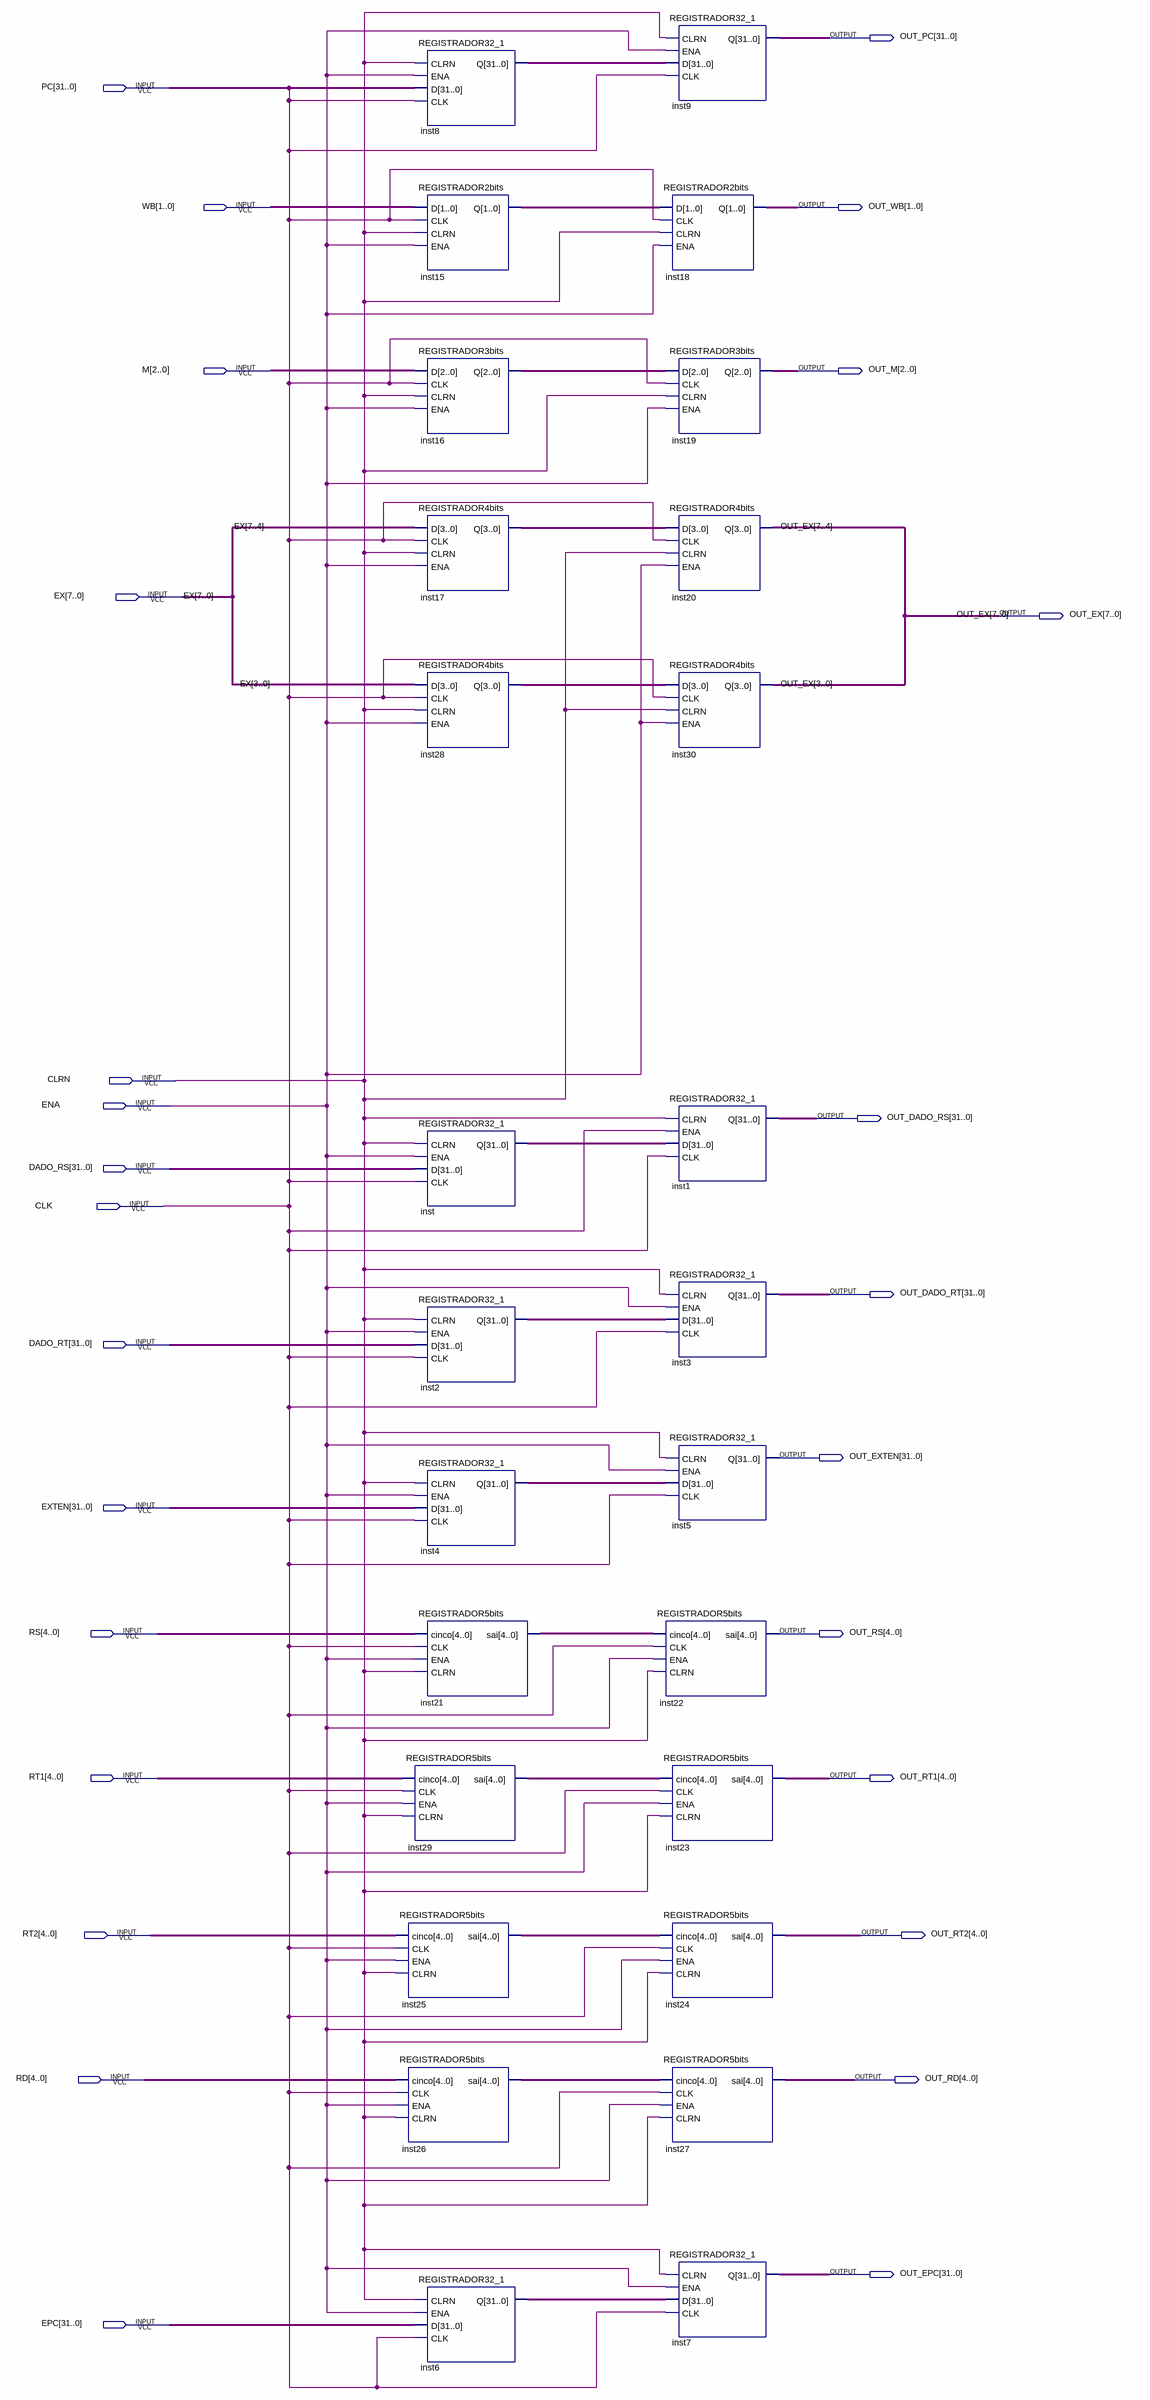
[diagram p0: schematic sheet]
// Quartus schematic ID_PARA_EX.bdf as structural Verilog: 26 symbols, 27 pins
module ID_PARA_EX (
  input  [31:0] PC,
  input  [1:0] WB,
  input  [2:0] M,
  input  [7:0] EX,
  input  CLRN,
  input  ENA,
  input  [31:0] DADO_RS,
  input  CLK,
  input  [31:0] DADO_RT,
  input  [31:0] EXTEN,
  input  [4:0] RS,
  input  [4:0] RT1,
  input  [4:0] RT2,
  input  [4:0] RD,
  input  [31:0] EPC,
  output [31:0] OUT_PC,
  output [1:0] OUT_WB,
  output [2:0] OUT_M,
  output [7:0] OUT_EX,
  output [31:0] OUT_DADO_RS,
  output [31:0] OUT_DADO_RT,
  output [31:0] OUT_EXTEN,
  output [4:0] OUT_RS,
  output [4:0] OUT_RT1,
  output [4:0] OUT_RT2,
  output [4:0] OUT_RD,
  output [31:0] OUT_EPC
);

  wire [1:0] inst15_q;
  wire [2:0] inst16_q;
  wire [3:0] inst17_q, inst28_q;
  wire [4:0] inst21_sai, inst25_sai, inst26_sai, inst29_sai;
  wire [31:0] inst2_q, inst4_q, inst6_q, inst8_q, inst_q;

  REGISTRADOR32_1 inst8 (.CLRN(CLRN), .ENA(ENA), .D(PC), .CLK(CLK), .Q(inst8_q));
  REGISTRADOR2bits inst15 (.D(WB), .CLK(CLK), .CLRN(CLRN), .ENA(ENA), .Q(inst15_q));
  REGISTRADOR3bits inst16 (.D(M), .CLK(CLK), .CLRN(CLRN), .ENA(ENA), .Q(inst16_q));
  REGISTRADOR4bits inst17 (.D(EX[7:4]), .CLK(CLK), .CLRN(CLRN), .ENA(ENA), .Q(inst17_q));
  REGISTRADOR4bits inst28 (.D(EX[3:0]), .CLK(CLK), .CLRN(CLRN), .ENA(ENA), .Q(inst28_q));
  REGISTRADOR32_1 inst (.CLRN(CLRN), .ENA(ENA), .D(DADO_RS), .CLK(CLK), .Q(inst_q));
  REGISTRADOR32_1 inst2 (.CLRN(CLRN), .ENA(ENA), .D(DADO_RT), .CLK(CLK), .Q(inst2_q));
  REGISTRADOR32_1 inst4 (.CLRN(CLRN), .ENA(ENA), .D(EXTEN), .CLK(CLK), .Q(inst4_q));
  REGISTRADOR5bits inst21 (.cinco(RS), .CLK(CLK), .ENA(ENA), .CLRN(CLRN), .sai(inst21_sai));
  REGISTRADOR5bits inst29 (.cinco(RT1), .CLK(CLK), .ENA(ENA), .CLRN(CLRN), .sai(inst29_sai));
  REGISTRADOR5bits inst25 (.cinco(RT2), .CLK(CLK), .ENA(ENA), .CLRN(CLRN), .sai(inst25_sai));
  REGISTRADOR5bits inst26 (.cinco(RD), .CLK(CLK), .ENA(ENA), .CLRN(CLRN), .sai(inst26_sai));
  REGISTRADOR32_1 inst6 (.CLRN(CLRN), .ENA(ENA), .D(EPC), .CLK(CLK), .Q(inst6_q));
  REGISTRADOR32_1 inst9 (.CLRN(CLRN), .ENA(ENA), .D(inst8_q), .CLK(CLK), .Q(OUT_PC));
  REGISTRADOR2bits inst18 (.D(inst15_q), .CLK(CLK), .CLRN(CLRN), .ENA(ENA), .Q(OUT_WB));
  REGISTRADOR3bits inst19 (.D(inst16_q), .CLK(CLK), .CLRN(CLRN), .ENA(ENA), .Q(OUT_M));
  REGISTRADOR4bits inst20 (.D(inst17_q), .CLK(CLK), .CLRN(CLRN), .ENA(ENA), .Q(OUT_EX[7:4]));
  REGISTRADOR4bits inst30 (.D(inst28_q), .CLK(CLK), .CLRN(CLRN), .ENA(ENA), .Q(OUT_EX[3:0]));
  REGISTRADOR32_1 inst1 (.CLRN(CLRN), .ENA(CLK), .D(inst_q), .CLK(CLK), .Q(OUT_DADO_RS));
  REGISTRADOR32_1 inst3 (.CLRN(CLRN), .ENA(ENA), .D(inst2_q), .CLK(CLK), .Q(OUT_DADO_RT));
  REGISTRADOR32_1 inst5 (.CLRN(CLRN), .ENA(ENA), .D(inst4_q), .CLK(CLK), .Q(OUT_EXTEN));
  REGISTRADOR5bits inst22 (.cinco(inst21_sai), .CLK(CLK), .ENA(ENA), .CLRN(CLRN), .sai(OUT_RS));
  REGISTRADOR5bits inst23 (.cinco(inst29_sai), .CLK(CLK), .ENA(ENA), .CLRN(CLRN), .sai(OUT_RT1));
  REGISTRADOR5bits inst24 (.cinco(inst25_sai), .CLK(CLK), .ENA(ENA), .CLRN(CLRN), .sai(OUT_RT2));
  REGISTRADOR5bits inst27 (.cinco(inst26_sai), .CLK(CLK), .ENA(ENA), .CLRN(CLRN), .sai(OUT_RD));
  REGISTRADOR32_1 inst7 (.CLRN(CLRN), .ENA(ENA), .D(inst6_q), .CLK(CLK), .Q(OUT_EPC));
endmodule
